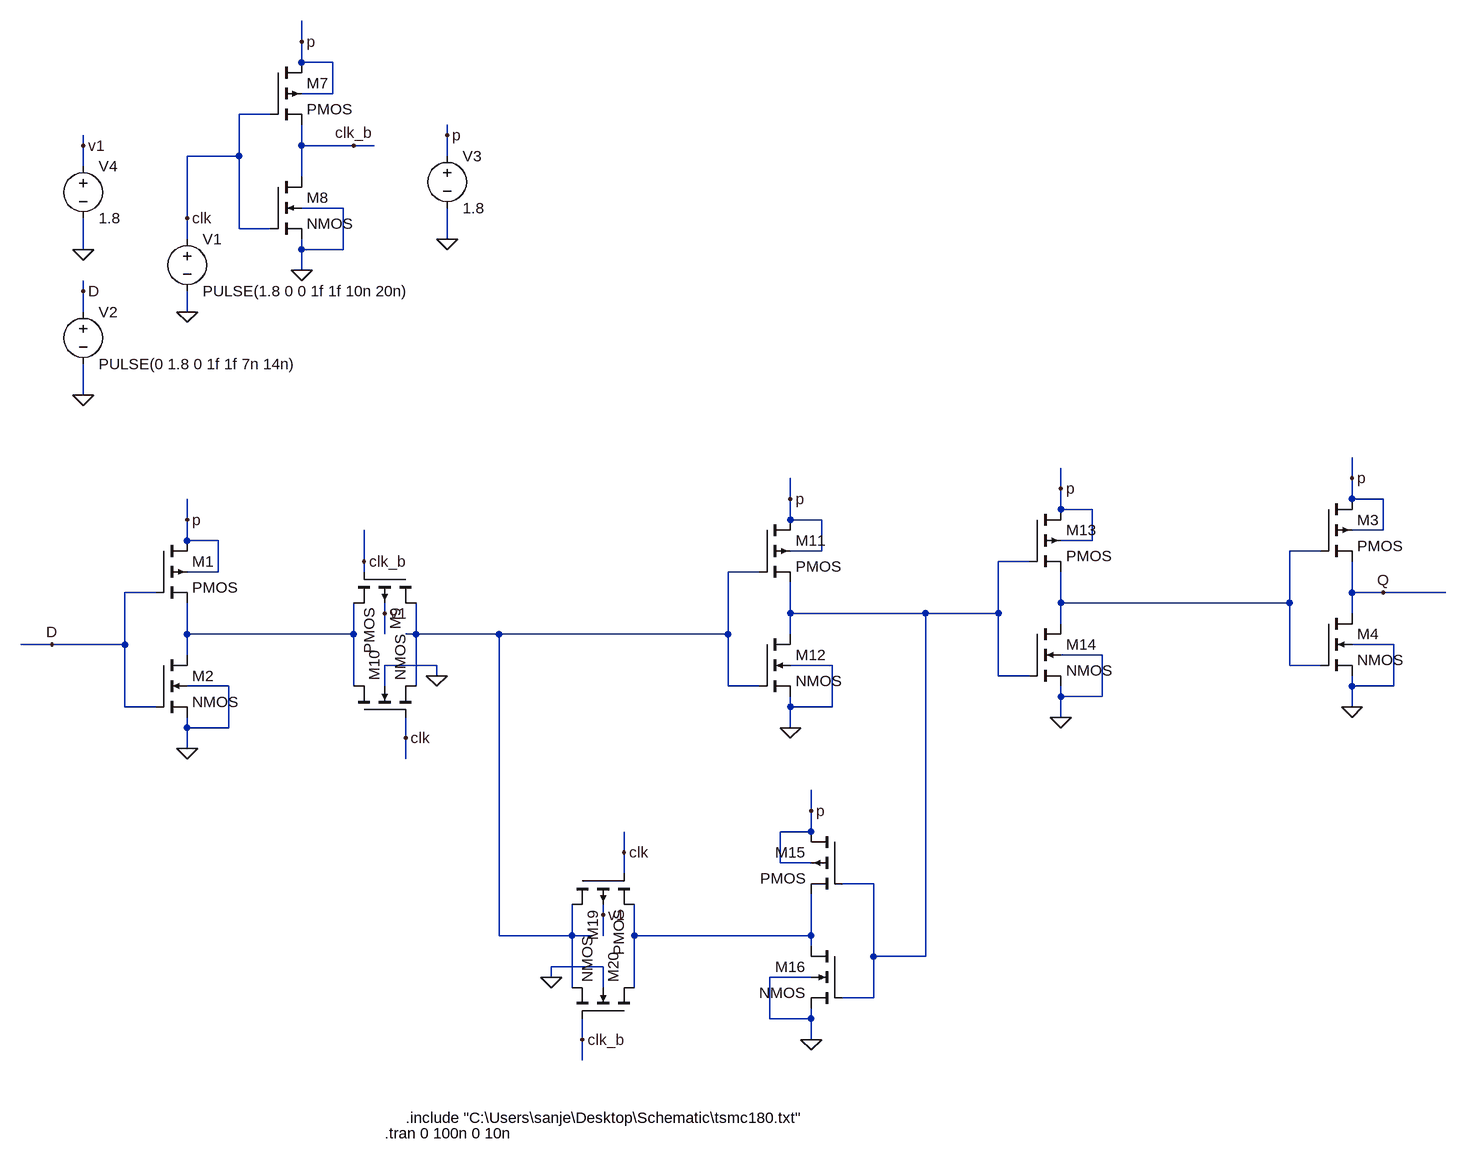
[diagram p0: schematic Positive level D latch.asc]
Positive level D latch.asc, the LTspice schematic file:
Version 4.1
SHEET 1 2500 960
WIRE -144 -736 -144 -768
WIRE -144 -704 -144 -736
WIRE -96 -704 -144 -704
WIRE -96 -656 -96 -704
WIRE -96 -656 -144 -656
WIRE -192 -624 -240 -624
WIRE 80 -592 80 -608
WIRE -480 -576 -480 -592
WIRE -144 -576 -144 -608
WIRE -64 -576 -144 -576
WIRE -32 -576 -64 -576
WIRE -240 -560 -240 -624
WIRE -240 -560 -320 -560
WIRE 80 -560 80 -592
WIRE -480 -544 -480 -576
WIRE -144 -528 -144 -576
WIRE -80 -480 -144 -480
WIRE -320 -464 -320 -560
WIRE -240 -448 -240 -560
WIRE -192 -448 -240 -448
WIRE -320 -432 -320 -464
WIRE 80 -432 80 -480
WIRE -480 -416 -480 -464
WIRE -144 -416 -144 -432
WIRE -80 -416 -80 -480
WIRE -80 -416 -144 -416
WIRE -144 -384 -144 -416
WIRE -480 -352 -480 -368
WIRE -480 -320 -480 -352
WIRE -320 -320 -320 -352
WIRE -480 -192 -480 -240
WIRE 1472 -64 1472 -96
WIRE 1024 -48 1024 -80
WIRE 608 -32 608 -64
WIRE 1472 -32 1472 -64
WIRE 1520 -32 1472 -32
WIRE 1024 -16 1024 -48
WIRE 1072 -16 1024 -16
WIRE -320 0 -320 -32
WIRE 608 0 608 -32
WIRE 656 0 608 0
WIRE 1520 16 1520 -32
WIRE 1520 16 1472 16
WIRE -320 32 -320 0
WIRE -272 32 -320 32
WIRE 1072 32 1072 -16
WIRE 1072 32 1024 32
WIRE 656 48 656 0
WIRE 656 48 608 48
WIRE 1424 48 1376 48
WIRE -48 64 -48 16
WIRE 976 64 928 64
WIRE -272 80 -272 32
WIRE -272 80 -320 80
WIRE -48 80 -48 64
WIRE 560 80 512 80
WIRE -368 112 -416 112
WIRE 1472 112 1472 64
WIRE 1520 112 1472 112
WIRE 1616 112 1520 112
WIRE 1024 128 1024 80
WIRE 1376 128 1376 48
WIRE 1376 128 1024 128
WIRE -16 144 -16 128
WIRE 608 144 608 96
WIRE 816 144 608 144
WIRE 928 144 928 64
WIRE 928 144 816 144
WIRE 1472 144 1472 112
WIRE 1024 160 1024 128
WIRE -320 176 -320 128
WIRE -64 176 -64 128
WIRE -64 176 -320 176
WIRE -16 176 -16 144
WIRE 32 176 32 128
WIRE 32 176 16 176
WIRE 160 176 32 176
WIRE 512 176 512 80
WIRE 512 176 160 176
WIRE 608 176 608 144
WIRE -528 192 -576 192
WIRE -416 192 -416 112
WIRE -416 192 -528 192
WIRE 1536 192 1472 192
WIRE -320 208 -320 176
WIRE 1088 208 1024 208
WIRE 64 224 -16 224
WIRE 672 224 608 224
WIRE 1376 224 1376 128
WIRE 1424 224 1376 224
WIRE 64 240 64 224
WIRE 928 240 928 144
WIRE 976 240 928 240
WIRE -256 256 -320 256
WIRE -64 256 -64 176
WIRE -16 256 -16 224
WIRE 32 256 32 176
WIRE 512 256 512 176
WIRE 560 256 512 256
WIRE 1472 256 1472 240
WIRE 1536 256 1536 192
WIRE 1536 256 1472 256
WIRE 1024 272 1024 256
WIRE 1088 272 1088 208
WIRE 1088 272 1024 272
WIRE -416 288 -416 192
WIRE -368 288 -416 288
WIRE 608 288 608 272
WIRE 672 288 672 224
WIRE 672 288 608 288
WIRE 1472 288 1472 256
WIRE 1024 304 1024 272
WIRE -320 320 -320 304
WIRE -256 320 -256 256
WIRE -256 320 -320 320
WIRE 608 320 608 288
WIRE 16 336 16 304
WIRE -320 352 -320 320
WIRE 16 368 16 336
WIRE 640 448 640 416
WIRE 640 480 640 448
WIRE 640 480 592 480
WIRE 352 512 352 480
WIRE 592 528 592 480
WIRE 640 528 592 528
WIRE 352 544 352 512
WIRE 736 560 688 560
WIRE 320 608 320 592
WIRE 160 640 160 176
WIRE 272 640 272 592
WIRE 272 640 160 640
WIRE 304 640 272 640
WIRE 320 640 320 608
WIRE 368 640 368 592
WIRE 640 640 640 576
WIRE 640 640 368 640
WIRE 640 656 640 640
WIRE 736 672 736 560
WIRE 816 672 816 144
WIRE 816 672 736 672
WIRE 320 688 240 688
WIRE 240 704 240 688
WIRE 640 704 576 704
WIRE 272 720 272 640
WIRE 320 720 320 688
WIRE 368 720 368 640
WIRE 736 736 736 672
WIRE 736 736 688 736
WIRE 576 768 576 704
WIRE 640 768 640 752
WIRE 640 768 576 768
WIRE 288 800 288 768
WIRE 640 800 640 768
WIRE 288 832 288 800
FLAG -480 -192 0
FLAG -480 -352 D
FLAG -320 -320 0
FLAG -320 -464 clk
FLAG 80 -432 0
FLAG 80 -592 p
FLAG -144 -384 0
FLAG -144 -736 p
FLAG -64 -576 clk_b
FLAG -480 -416 0
FLAG -480 -576 v1
FLAG -320 352 0
FLAG -320 0 p
FLAG 608 320 0
FLAG 608 -32 p
FLAG 1024 304 0
FLAG 1024 -48 p
FLAG 640 800 0
FLAG 640 448 p
FLAG -16 144 v1
FLAG 64 240 0
FLAG 320 608 v1
FLAG 240 704 0
FLAG 16 336 clk
FLAG 352 512 clk
FLAG -48 64 clk_b
FLAG 288 800 clk_b
FLAG -528 192 D
FLAG 1472 288 0
FLAG 1472 -64 p
FLAG 1520 112 Q
SYMBOL voltage -480 -336 R0
WINDOW 123 0 0 Left 0
WINDOW 39 0 0 Left 0
SYMATTR InstName V2
SYMATTR Value PULSE(0 1.8 0 1f 1f 7n 14n)
SYMBOL voltage -320 -448 R0
WINDOW 123 0 0 Left 0
WINDOW 39 0 0 Left 0
SYMATTR InstName V1
SYMATTR Value PULSE(1.8 0 0 1f 1f 10n 20n)
SYMBOL voltage 80 -576 R0
WINDOW 123 0 0 Left 0
WINDOW 39 0 0 Left 0
SYMATTR InstName V3
SYMATTR Value 1.8
SYMBOL pmos4 -192 -704 R0
SYMATTR InstName M7
SYMATTR Value2 l=0.18u w=0.4u
SYMBOL nmos4 -192 -528 R0
SYMATTR InstName M8
SYMATTR Value2 l=0.18u w=0.2u
SYMBOL voltage -480 -560 R0
WINDOW 123 0 0 Left 0
WINDOW 39 0 0 Left 0
SYMATTR InstName V4
SYMATTR Value 1.8
SYMBOL pmos4 -368 32 R0
SYMATTR InstName M1
SYMATTR Value2 l=0.18u w=0.4u
SYMBOL nmos4 -368 208 R0
SYMATTR InstName M2
SYMATTR Value2 l=0.18u w=0.2u
SYMBOL pmos4 560 0 R0
SYMATTR InstName M11
SYMATTR Value2 l=0.18u w=0.4u
SYMBOL nmos4 560 176 R0
SYMATTR InstName M12
SYMATTR Value2 l=0.18u w=0.2u
SYMBOL pmos4 976 -16 R0
SYMATTR InstName M13
SYMATTR Value2 l=0.18u w=0.4u
SYMBOL nmos4 976 160 R0
SYMATTR InstName M14
SYMATTR Value2 l=0.18u w=0.2u
SYMBOL pmos4 688 480 M0
SYMATTR InstName M15
SYMATTR Value2 l=0.18u w=0.4u
SYMBOL nmos4 688 656 M0
SYMATTR InstName M16
SYMATTR Value2 l=0.18u w=0.2u
SYMBOL pmos4 32 80 R90
SYMATTR InstName M9
SYMATTR Value2 l=0.18u w=0.4u
SYMBOL nmos4 -64 304 R270
SYMATTR InstName M10
SYMATTR Value2 l=0.18u w=0.4u
SYMBOL pmos4 272 544 M90
SYMATTR InstName M19
SYMATTR Value2 l=0.18u w=0.4u
SYMBOL nmos4 368 768 M270
SYMATTR InstName M20
SYMATTR Value2 l=0.18u w=0.4u
SYMBOL pmos4 1424 -32 R0
SYMATTR InstName M3
SYMATTR Value2 l=0.18u w=0.4u
SYMBOL nmos4 1424 144 R0
SYMATTR InstName M4
SYMATTR Value2 l=0.18u w=0.2u
TEXT 16 920 Left 2 !.include "C:\\Users\\sanje\\Desktop\\Schematic\\tsmc180.txt"
TEXT -16 944 Left 2 !.tran 0 100n 0 10n

The netlist it stands for:
* Positive level D latch.asc
V2 D 0 PULSE(0 1.8 0 1f 1f 7n 14n)
V1 clk 0 PULSE(1.8 0 0 1f 1f 10n 20n)
V3 p 0 1.8
M7 p clk clk_b p PMOS l=0.18u w=0.4u
M8 clk_b clk 0 0 NMOS l=0.18u w=0.2u
V4 v1 0 1.8
M1 p D N004 p PMOS l=0.18u w=0.4u
M2 N004 D 0 0 NMOS l=0.18u w=0.2u
M11 p N003 N002 p PMOS l=0.18u w=0.4u
M12 N002 N003 0 0 NMOS l=0.18u w=0.2u
M13 p N002 N001 p PMOS l=0.18u w=0.4u
M14 N001 N002 0 0 NMOS l=0.18u w=0.2u
M15 p N002 N005 p PMOS l=0.18u w=0.4u
M16 N005 N002 0 0 NMOS l=0.18u w=0.2u
M9 N003 clk_b N004 v1 PMOS l=0.18u w=0.4u
M10 N004 clk N003 0 NMOS l=0.18u w=0.4u
M19 N003 clk N005 v1 PMOS l=0.18u w=0.4u
M20 N005 clk_b N003 0 NMOS l=0.18u w=0.4u
M3 p N001 Q p PMOS l=0.18u w=0.4u
M4 Q N001 0 0 NMOS l=0.18u w=0.2u
.model NMOS NMOS
.model PMOS PMOS
.lib standard.mos
.include "C:\Users\sanje\Desktop\Schematic\tsmc180.txt"
.tran 0 100n 0 10n
.backanno
.end